# EAGLE schematic OnStep Box SCH (EAGLE 9.6.2)
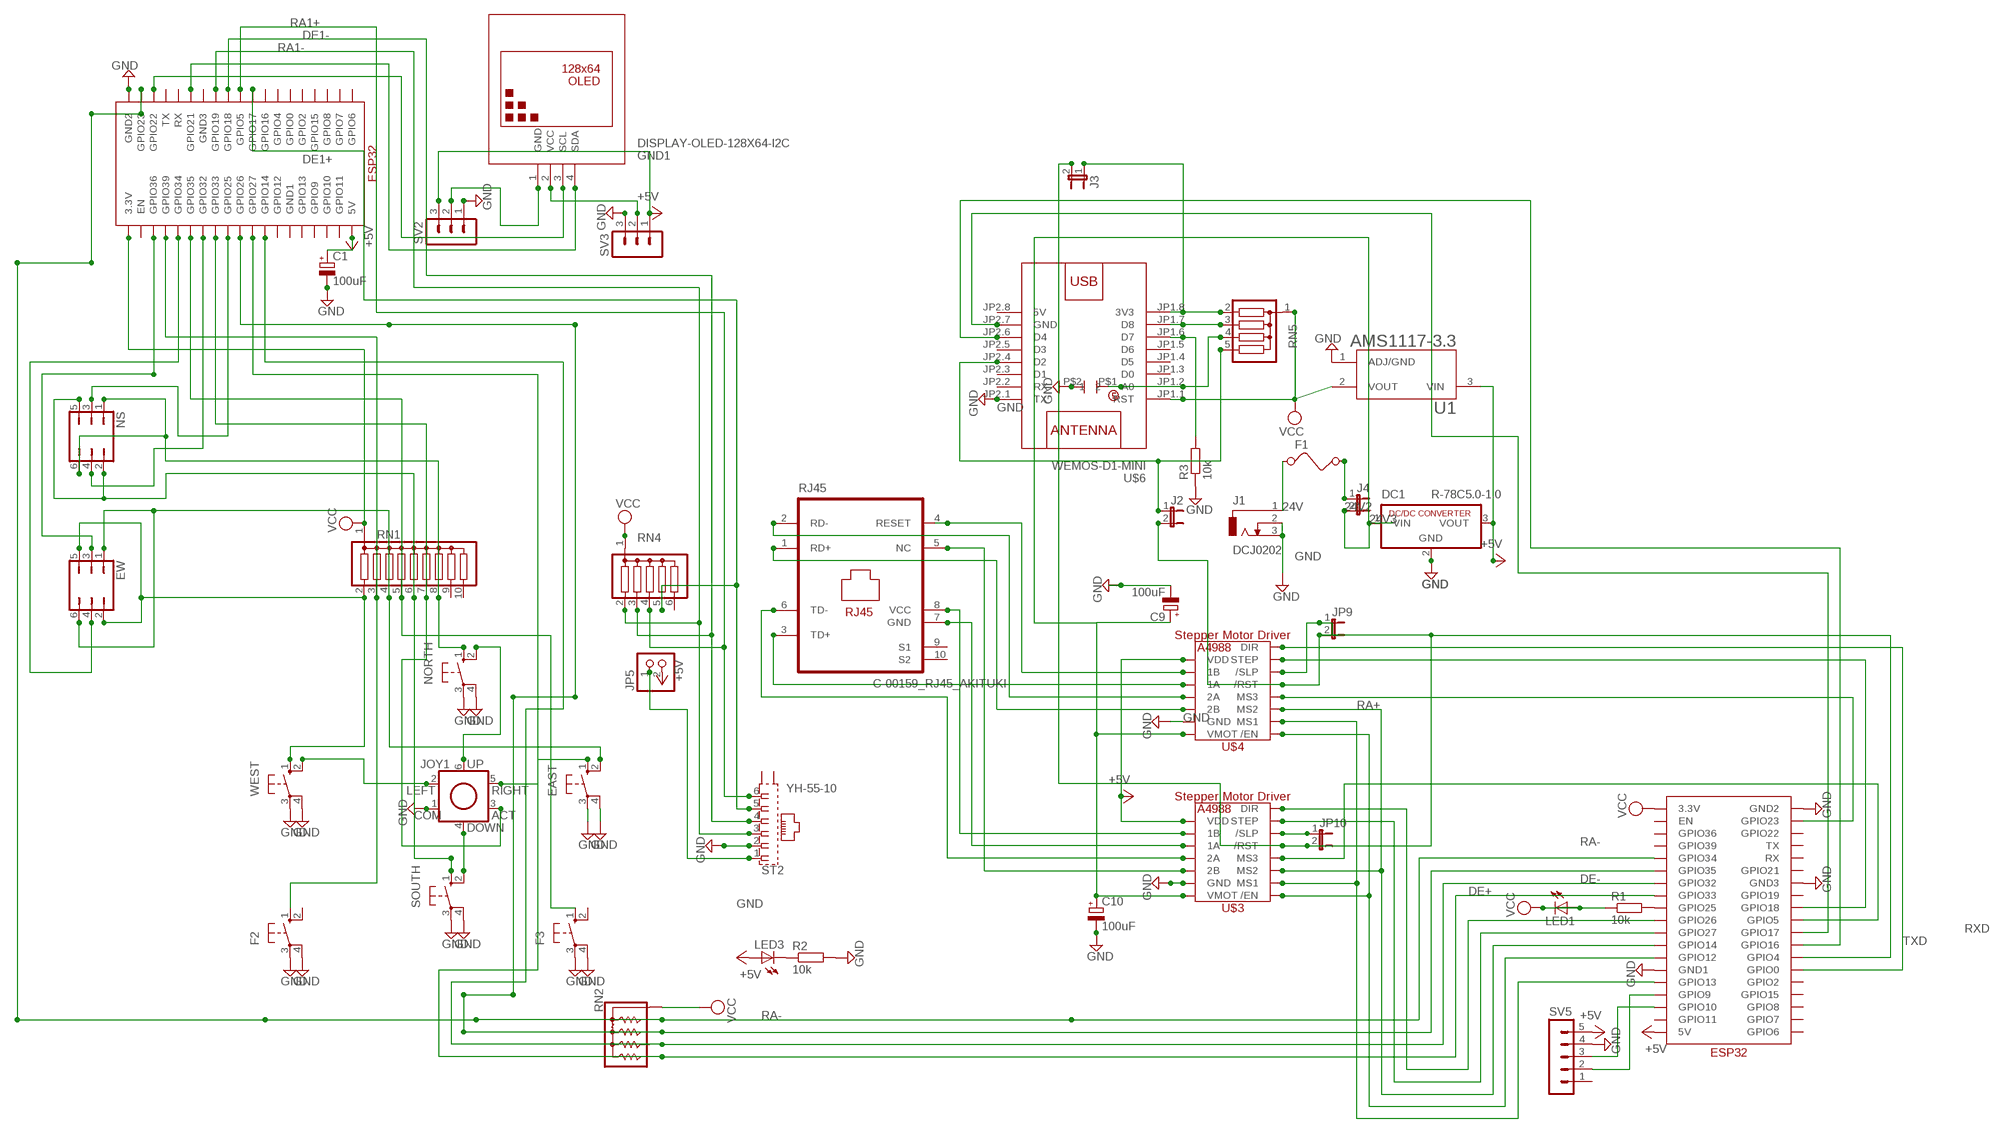
[diagram p0: schematic, sheet 1]

## Parts
C1  100uF  CPOL-EUE2-4  [E2-4]
C9  100uF  CPOL-EUE2-5  [E2-5]
C10  100uF  CPOL-EUE2-5  [E2-5]
CERAMIC_CAPACITOR1  CERAMIC_CAPACITOR  [CERAMIC_CAPACITOR]
DC1  R-78C5.0-1.0  [SIP3]
EAST  40-XX  [B3F-40XX]
EW  JP3Q  [JP3Q]
F1  FUSE  [FUSE]
F2  10-XX  [B3F-10XX]
F3  10-XX  [B3F-10XX]
GND1  DISPLAY-OLED-128X64-I2C  [DISPLAY-OLED-128X64-I2C]
J1  DCJ0202  [DCJ0202]
J2  JP1E  [JP1]
J3  JP1E  [JP1]
J4  JP1E  [JP1]
JOY1  JOYSTICK  [JOYSTICK]
JP5  PINHD-1X2  [1X02]
JP9  JP1E  [JP1]
JP10  JP1E  [JP1]
LED1  LEDSFH480  [SFH480]
LED3  LEDSFH480  [SFH480]
NORTH  40-XX  [B3F-40XX]
NS  JP3Q  [JP3Q]
R1  10k  R-EU_0204/5  [0204/5]
R2  10k  R-EU_0204/5  [0204/5]
R3  10k  R-EU_0204/5  [0204/5]
RJ45  C-00159_RJ45_AKITUKI  [PJ-J0]
RN1  G09R  [SIL10]
RN2  4605X  [SIP5]
RN4  G05R  [SIL6]
RN5  G04R  [SIL5]
SOUTH  40-XX  [B3F-40XX]
ST2  YH-55-10  [YH-55-10]
SV2  MA03-1  [MA03-1]
SV3  MA03-1  [MA03-1]
SV5  MA05-1  [MA05-1]
U1  AMS1117-3.3  [SOT229P700X180-4N]
U$1  ESP32  [ESP32]
U$3  A4988_STEP  [A4988_STEP]
U$4  A4988_STEP  [A4988_STEP]
U$6  WEMOS-D1-MINI  [WEMOS-D1-MINI]
U$7  ESP32  [ESP32]
WEST  40-XX  [B3F-40XX]

## Nets
24V [24v]: F1.1 J1.1
24V2 [24v]: F1.2 J4.1
24V3 [24v]: C9.+ C10.+ DC1.1(VIN) J4.2 U$3.VMOT U$4.VMOT
+5V: C1.+ DC1.3(VOUT) JP5.2 LED3.A SV2.3 SV3.1 SV5.5 U1.3(VIN) U$1.5V U$3.VDD U$4.VDD U$7.5V
DE1+: RN4.5 ST2.5 U$7.GPIO17
DE1-: RN4.3 ST2.4 U$7.GPIO18
DE+: RN2.5 U$1.GPIO33 U$7.GPIO27
DE-: RN2.4 U$1.GPIO32 U$7.GPIO14
GND: C1.- C9.- C10.- CERAMIC_CAPACITOR1.P$2 DC1.2(GND) EAST.3(P) EAST.4(P1) F2.3(P) F2.4(P1) F3.3(P) F3.4(P1) J1.2 J1.3 JOY1.1(COM) NORTH.3(P) NORTH.4(P1) R2.2 R3.1 SOUTH.3(P) SOUTH.4(P1) ST2.2 SV2.1 SV3.3 SV5.4 U1.1(ADJ/GND) U$1.GND1 U$1.GND2 U$1.GND3 U$3.GND U$3.GND2(GND) U$4.GND U$4.GND2(GND) U$6.JP2.1(TX) U$7.GND2 WEST.3(P) WEST.4(P1)
N$1: GND1.1(GND) SV2.2
N$2: LED3.K(C) R2.1
N$3: R1.2 U$1.GPIO25
N$8: SV5.3 U$1.GPIO10
N$9: SV5.2 U$1.GPIO9
N$13: U$1.GPIO12 U$3./EN U$4./EN
N$14: U$1.GPIO13 U$3.MS1 U$4.MS1
N$15: U$1.GPIO14 U$3.MS2 U$4.MS2
N$20: JP10.1 U$3./SLP
N$21: U$1.GPIO26 U$3.DIR
N$22: U$1.GPIO27 U$3.STEP
N$23: U$1.GPIO23 U$4.MS3
N$24: J2.2 J3.2 JP9.1 JP9.2 JP10.2 U$1.GPIO4 U$3./RST U$4./RST U$4./SLP
N$25: J3.1 RN5.2 U$6.JP1.8(3V3)
N$27: U$1.GPIO18 U$4.STEP
N$28: RJ45.4(RESET) U$4.1B
N$29 [SPM]: RJ45.5(NC) U$3.2B
N$30 [SPM]: RJ45.8(VCC) U$3.1B
N$31: GND1.2(VCC) SV3.2
N$32 [SPM]: RJ45.7(GND) U$3.1A
N$33: RN5.3 U$6.JP1.7(D8)
N$34 [SPM]: RJ45.6(TD-) U$3.2A
N$35: U$1.GPIO5 U$3.MS3
N$36: R3.2 U$6.JP1.6(D7)
N$37: CERAMIC_CAPACITOR1.P$1 RN5.4 U$6.JP1.2(A0)
N$38: U$1.GPIO0 U$4.DIR
N$40 [SPM]: RJ45.2(RD-) U$4.2A
N$42 [SPM]: RJ45.1(RD+) U$4.2B
N$45: J2.1 RN5.5 U$6.JP2.4(D2)
N$46 [SPM]: RJ45.3(TD+) U$4.1A
N$47: GND1.3(SCL) U$7.GPIO22
N$51: GND1.4(SDA) U$7.GPIO21
N$53: EW.3 U$7.GPIO36
N$54: EAST.2(S1) EW.1 EW.6 RN1.4
N$55: NS.2 NS.5 RN1.6 SOUTH.1(S)
N$58: JOY1.2(LEFT) WEST.2(S1)
N$59: EAST.1(S) JOY1.5(RIGHT)
N$60: NORTH.1(S) NS.1 NS.6 RN1.8
N$61: JP5.1 ST2.1
N$67: F2.1(S) RN1.3 U$7.GPIO39
N$68: F3.1(S) RN1.5 U$7.GPIO35
N$70: NS.3 U$7.GPIO25
N$71: NS.4 U$7.GPIO32
N$72: EW.2 EW.5 RN1.2 WEST.1(S)
N$73: EW.4 U$7.GPIO34
N$74: JOY1.6(UP) NORTH.2(S1)
N$75: JOY1.4(DOWN) SOUTH.2(S1)
N$77: JOY1.3(ACT) RN1.7 U$7.GPIO33
RA1+: RN4.4 ST2.6 U$7.GPIO5
RA1-: RN4.2 ST2.3 U$7.GPIO19
RA+: RN2.3 U$1.GPIO35 U$7.GPIO26
RA-: RN2.2 U$1.GPIO34 U$7.GPIO23
RXD: U$1.GPIO17 U$6.JP2.7(GND)
TXD: U$1.GPIO16 U$6.JP2.6(D4)
VCC: LED1.A LED1.K(C) R1.1 RN1.1 RN2.1 RN4.1 RN5.1 U1.2(VOUT) U$1.3.3V U$6.JP1.1(RST) U$7.3.3V
Unconnected: F2.2(S1) F3.2(S1) RJ45.9(S1) RJ45.10(S2) RN1.9 RN1.10 RN4.6 ST2.S1(S) ST2.S2(S) SV5.1 U$1.EN U$1.GPIO2 U$1.GPIO6 U$1.GPIO7 U$1.GPIO8 U$1.GPIO11 U$1.GPIO15 U$1.GPIO19 U$1.GPIO21 U$1.GPIO22 U$1.GPIO36 U$1.GPIO39 U$1.RX U$1.TX U$6.JP1.3(D0) U$6.JP1.4(D5) U$6.JP1.5(D6) U$6.JP2.2(RX) U$6.JP2.3(D1) U$6.JP2.5(D3) U$7.EN U$7.GND1 U$7.GND3 U$7.GPIO0 U$7.GPIO2 U$7.GPIO4 U$7.GPIO6 U$7.GPIO7 U$7.GPIO8 U$7.GPIO9 U$7.GPIO10 U$7.GPIO11 U$7.GPIO12 U$7.GPIO13 U$7.GPIO15 U$7.GPIO16 U$7.RX U$7.TX

## Power pins joined to a net without a drawn wire
5V: U$6.JP2.8(5V)

## Library data of the parts
C1 = akihabara:CPOL-EU: POLARIZED CAPACITOR, European symbol
C9 C10 = rcl:CPOL-EU: POLARIZED CAPACITOR, European symbol; SPICEPREFIX: C
CERAMIC_CAPACITOR1 = capacitor:CERAMIC_CAPACITOR: ceramic_capacitor
DC1 = dc-dc-converter:R-78C*-1.0: INNOLINE DC/DC-Converter 1.0 AMP SIP3 Single Output Source: Data sheet <http://www.mikrocontroller.net/attachment/150645/157764-da-01-en-DC_DC_WANDLER_R_78C5_0_1_0.pdf>
EAST NORTH SOUTH WEST = switch-omron:40-XX: OMRON SWITCH; MF: OMRON COMPONENTS USA; MPN: B3F-4000; OC_FARNELL: 176434; OC_NEWARK: 36K3105
EW NS = jumper:JP3Q: JUMPER
F1 = special:FUSE: FUSE 5 x 20 mm
F2 F3 = switch-omron:10-XX: OMRON SWITCH; MPN: B3F-1000; OC_FARNELL: 176432; OC_NEWARK: 36M3542
GND1 = diy-modules:DISPLAY-OLED-128X64-I2C: 128x64 Dot Matrix OLED Module based on SSD1306 chip Variant with I2C interface More details available here: http://www.instructables.com/id/Monochrome-096-i2c-OLED-display-with-arduino-SSD13/ SSD1306 datasheet: https://cdn-shop.adafruit.com/datasheets/SSD1306.pdf Click here to find device on ebay.com <http://www.ebay.com/sch/oled+display+128x64+iic> Note: There are two variants: I2C and SPI. Search for the proper version.
J1 = akihabara:DCJ0202: DC POWER JACK Source: DCJ0202.pdf
J2-J4 JP9 JP10 = jumper:JP1E: JUMPER
JOY1 = dp_devices:JOYSTICK
JP5 = pinhead:PINHD-1X2: PIN HEADER
LED1 LED3 = LED:LED: LED OSRAM: - CHIPLED LG R971, LG N971, LY N971, LG Q971, LY Q971, LO R971, LY R971 LH N974, LH R974 LS Q976, LO Q976, LY Q976 LO Q996 - Hyper CHIPLED LW Q18S LB Q993, LB Q99A, LB R99A - SideLED LS A670, LO A670, LY A670, LG A670, LP A670 LB A673, LV A673, LT A673, LW A673 LH A674 LY A675 LS A676, LA A676, LO A676, LY A676, LW A676 LS A679, LY A679, LG A679 - Hyper Micro SIDELED® LS Y876, LA Y876, LO Y876, LY Y876 LT Y87S - SmartLED LW L88C, LW L88S LB L89C, LB L89S, LG L890 LS L89K, LO L89K, LY L89K LS L896, LA L896, LO L896, LY L896 - TOPLED LS T670, LO T670, LY T670, LG T670, LP T670 LSG T670, LSP T670, LSY T670, LOP T670, LYG T670 LG T671, LOG T671, LSG T671 LB T673, LV T673, LT T673, LW T673 LH T674 LS T676, LA T676, LO T676, LY T676, LB T676, LH T676, LSB T676, LW T676 LB T67C, LV T67C, LT T67C, LS T67K, LO T67K, LY T67K, LW E67C LS E67B, LA E67B, LO E67B, LY E67B, LB E67C, LV E67C, LT E67C LW T67C LS T679, LY T679, LG T679 LS T770, LO T770, LY T770, LG T770, LP T770 LB T773, LV T773, LT T773, LW T773 LH T774 LS E675, LA E675, LY E675, LS T675 LS T776, LA T776, LO T776, LY T776, LB T776 LHGB T686 LT T68C, LB T68C - Hyper Mini TOPLED® LB M676 - Mini TOPLED Santana® LG M470 LS M47K, LO M47K, LY M47K Source: http://www.osram.convergy.de LUXEON: - LUMILED® LXK2-PW12-R00, LXK2-PW12-S00, LXK2-PW14-U00, LXK2-PW14-V00 LXK2-PM12-R00, LXK2-PM12-S00, LXK2-PM14-U00 LXK2-PE12-Q00, LXK2-PE12-R00, LXK2-PE12-S00, LXK2-PE14-T00, LXK2-PE14-U00 LXK2-PB12-K00, LXK2-PB12-L00, LXK2-PB12-M00, LXK2-PB14-N00, LXK2-PB14-P00, LXK2-PB14-Q00 LXK2-PR12-L00, LXK2-PR12-M00, LXK2-PR14-Q00, LXK2-PR14-R00 LXK2-PD12-Q00, LXK2-PD12-R00, LXK2-PD12-S00 LXK2-PH12-R00, LXK2-PH12-S00 LXK2-PL12-P00, LXK2-PL12-Q00, LXK2-PL12-R00 Source: www.luxeon.com KINGBRIGHT: KA-3528ASYC Source: www.kingbright.com
R1-R3 = rcl:R-EU_: RESISTOR, European symbol; SPICEPREFIX: R
RJ45 = Akizuki:C-00159_RJ45_AKITUKI: RJ45 PulseJack w/LEDs
RN1 = resistor-sil:G09R: SIL RESISTOR; OC_FARNELL: unknown; OC_NEWARK: unknown
RN2 = resistor-sip:4605X: Bourns 4600X Series - Thick Film Conformal SIPs 4605X-101 Resistor Network Configuration: 101 (Bussed Resistors) Resistance range: 10 ohms to 10 Megaohms Maximum Operating Voltage: 100V Source: http://www.bourns.com/ProductLine.aspx?name=standard_thick_film_networks PDF: http://www.bourns.com/data/global/pdfs/4600X.pdf
RN4 = resistor-sil:G05R: SIL RESISTOR; OC_FARNELL: unknown; OC_NEWARK: unknown
RN5 = resistor-sil:G04R: SIL RESISTOR; OC_FARNELL: unknown; OC_NEWARK: unknown
ST2 = con-wenzhou-yihua:YH-55-10: RJ11 6 connects Source: YH-55-10.pdf; OC_FARNELL: unknown; OC_NEWARK: unknown
SV2 SV3 = con-lstb:MA03-1: PIN HEADER; OC_FARNELL: unknown; OC_NEWARK: unknown
SV5 = con-lstb:MA05-1: PIN HEADER; OC_FARNELL: unknown; OC_NEWARK: unknown
U1 = AMS1117-3.3:AMS1117-3.3: Sot223/Pkg 1-Amp 3.3-Volt Low Drop Out Voltage Regulatator Check prices <https://pricing.snapeda.com/parts/AMS1117-3.3/Advanced%20Monolithic%20Systems/view-part?ref=eda>; AVAILABILITY: In Stock; DESCRIPTION: LDO Voltage Regulators 800MA LDO LINEAR REG; MF: Advanced Monolithic Systems; MP: AMS1117-3.3; PACKAGE: SOT-223 Seeed Technology; PRICE: None
U$1 U$7 = ESP32:ESP32
U$3 U$4 = IC:A4988_STEP
U$6 = diy-modules:WEMOS-D1-MINI: WEMOS D1 mini: Mini Wi-Fi Board based on ESP-8266 device More details can be found here: https://www.wemos.cc/product/d1-mini.html Click here to find device on ebay.com <http://www.ebay.com/sch/wemos+d1+mini+nodemcu>

## Net classes
0 default: width 0.3 mm
1 24v: width 0.7 mm
2 SPM: width 0.3 mm
3 New Class: width 0.7 mm